# EAGLE design Breakout (EAGLE 7.2.0)
CNAME: EARS PocketQube Template; CREVISION: 0.1; DESIGNER: L. Stant
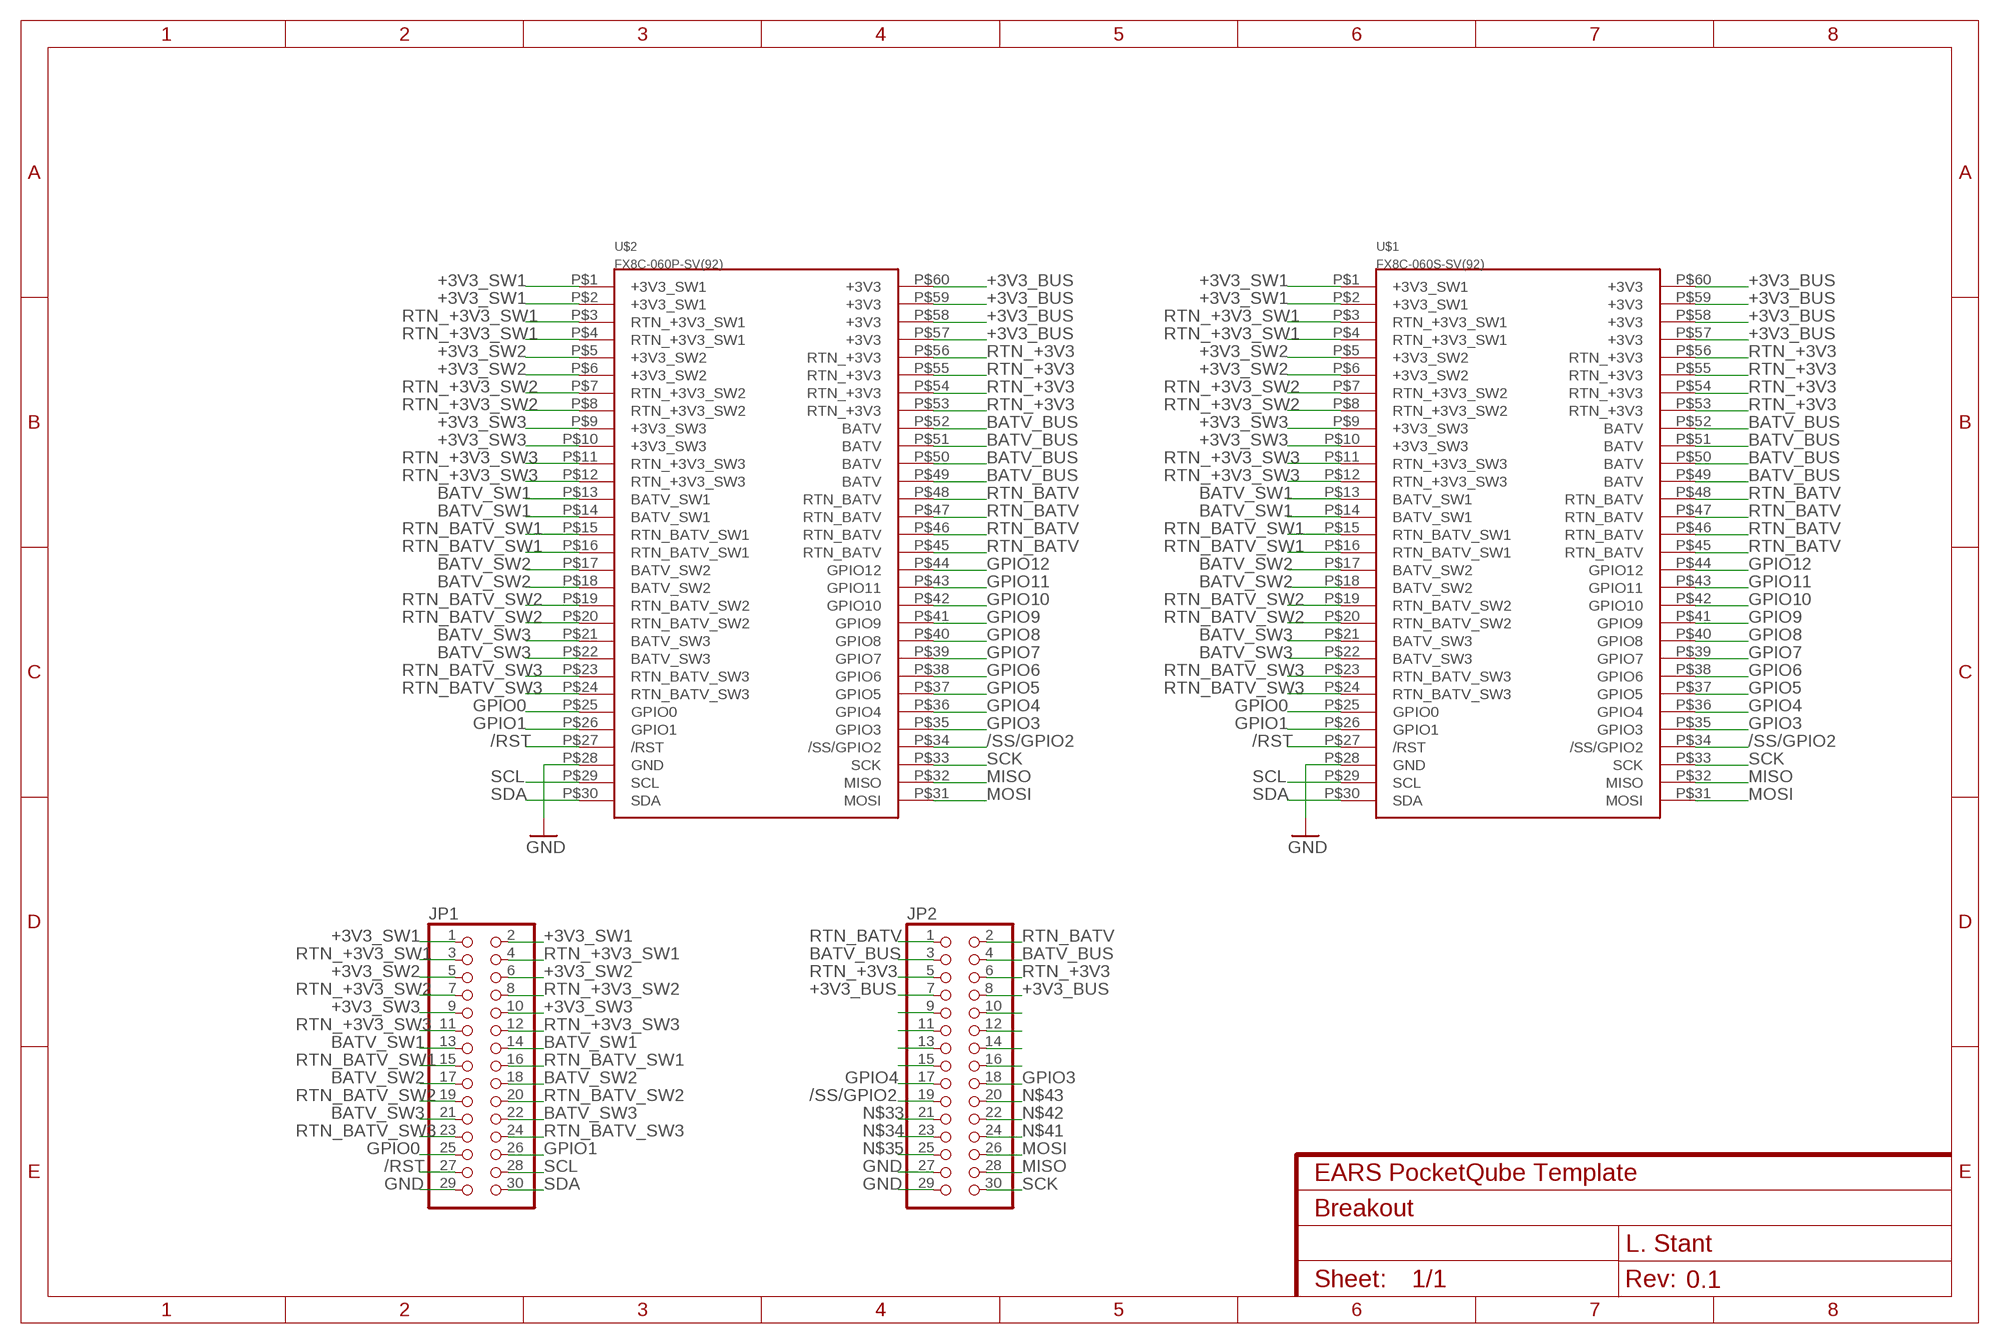
[diagram p0: schematic, sheet 1]

## Parts
JP1  PINHD-2X15  [2X15]
JP2  PINHD-2X15  [2X15]
U$1  FX8C-060S-SV(92)  [FX8C-060S-SV(92)]
U$2  FX8C-060P-SV(92)  [FX8C-060P-SV(92)]

## Nets
+3V3_BUS: JP2.7 JP2.8 U$1.P$57(+3V3) U$1.P$58(+3V3) U$1.P$59(+3V3) U$1.P$60(+3V3) U$2.P$57(+3V3) U$2.P$58(+3V3) U$2.P$59(+3V3) U$2.P$60(+3V3)
+3V3_SW1: JP1.1 JP1.2 U$1.P$1(+3V3_SW1) U$1.P$2(+3V3_SW1) U$2.P$1(+3V3_SW1) U$2.P$2(+3V3_SW1)
+3V3_SW2: JP1.5 JP1.6 U$1.P$5(+3V3_SW2) U$1.P$6(+3V3_SW2) U$2.P$5(+3V3_SW2) U$2.P$6(+3V3_SW2)
+3V3_SW3: JP1.9 JP1.10 U$1.P$9(+3V3_SW3) U$1.P$10(+3V3_SW3) U$2.P$9(+3V3_SW3) U$2.P$10(+3V3_SW3)
/RST: JP1.27 U$1.P$27(/RST) U$2.P$27(/RST)
/SS/GPIO2: JP2.19 U$1.P$34(/SS/GPIO2) U$2.P$34(/SS/GPIO2)
BATV_BUS: JP2.3 JP2.4 U$1.P$49(BATV) U$1.P$50(BATV) U$1.P$51(BATV) U$1.P$52(BATV) U$2.P$49(BATV) U$2.P$50(BATV) U$2.P$51(BATV) U$2.P$52(BATV)
BATV_SW1: JP1.13 JP1.14 U$1.P$13(BATV_SW1) U$1.P$14(BATV_SW1) U$2.P$13(BATV_SW1) U$2.P$14(BATV_SW1)
BATV_SW2: JP1.17 JP1.18 U$1.P$17(BATV_SW2) U$1.P$18(BATV_SW2) U$2.P$17(BATV_SW2) U$2.P$18(BATV_SW2)
BATV_SW3: JP1.21 JP1.22 U$1.P$21(BATV_SW3) U$1.P$22(BATV_SW3) U$2.P$21(BATV_SW3) U$2.P$22(BATV_SW3)
GND: JP1.29 JP2.27 JP2.29 U$1.P$28(GND) U$2.P$28(GND)
GPIO0: JP1.25 U$1.P$25(GPIO0) U$2.P$25(GPIO0)
GPIO1: JP1.26 U$1.P$26(GPIO1) U$2.P$26(GPIO1)
GPIO3: JP2.18 U$1.P$35(GPIO3) U$2.P$35(GPIO3)
GPIO4: JP2.17 U$1.P$36(GPIO4) U$2.P$36(GPIO4)
GPIO5: JP2.16 U$1.P$37(GPIO5) U$2.P$37(GPIO5)
GPIO6: JP2.15 U$1.P$38(GPIO6) U$2.P$38(GPIO6)
GPIO7: JP2.14 U$1.P$39(GPIO7) U$2.P$39(GPIO7)
GPIO8: JP2.13 U$1.P$40(GPIO8) U$2.P$40(GPIO8)
GPIO9: JP2.12 U$1.P$41(GPIO9) U$2.P$41(GPIO9)
GPIO10: JP2.11 U$1.P$42(GPIO10) U$2.P$42(GPIO10)
GPIO11: JP2.10 U$1.P$43(GPIO11) U$2.P$43(GPIO11)
GPIO12: JP2.9 U$1.P$44(GPIO12) U$2.P$44(GPIO12)
MISO: JP2.28 U$1.P$32(MISO) U$2.P$32(MISO)
MOSI: JP2.26 U$1.P$31(MOSI) U$2.P$31(MOSI)
N$33: JP2.21
N$34: JP2.23
N$35: JP2.25
N$41: JP2.24
N$42: JP2.22
N$43: JP2.20
RTN_+3V3: JP2.5 JP2.6 U$1.P$53(RTN_+3V3) U$1.P$54(RTN_+3V3) U$1.P$55(RTN_+3V3) U$1.P$56(RTN_+3V3) U$2.P$53(RTN_+3V3) U$2.P$54(RTN_+3V3) U$2.P$55(RTN_+3V3) U$2.P$56(RTN_+3V3)
RTN_+3V3_SW1: JP1.3 JP1.4 U$1.P$3(RTN_+3V3_SW1) U$1.P$4(RTN_+3V3_SW1) U$2.P$3(RTN_+3V3_SW1) U$2.P$4(RTN_+3V3_SW1)
RTN_+3V3_SW2: JP1.7 JP1.8 U$1.P$7(RTN_+3V3_SW2) U$1.P$8(RTN_+3V3_SW2) U$2.P$7(RTN_+3V3_SW2) U$2.P$8(RTN_+3V3_SW2)
RTN_+3V3_SW3: JP1.11 JP1.12 U$1.P$11(RTN_+3V3_SW3) U$1.P$12(RTN_+3V3_SW3) U$2.P$11(RTN_+3V3_SW3) U$2.P$12(RTN_+3V3_SW3)
RTN_BATV: JP2.1 JP2.2 U$1.P$45(RTN_BATV) U$1.P$46(RTN_BATV) U$1.P$47(RTN_BATV) U$1.P$48(RTN_BATV) U$2.P$45(RTN_BATV) U$2.P$46(RTN_BATV) U$2.P$47(RTN_BATV) U$2.P$48(RTN_BATV)
RTN_BATV_SW1: JP1.15 JP1.16 U$1.P$15(RTN_BATV_SW1) U$1.P$16(RTN_BATV_SW1) U$2.P$15(RTN_BATV_SW1) U$2.P$16(RTN_BATV_SW1)
RTN_BATV_SW2: JP1.19 JP1.20 U$1.P$19(RTN_BATV_SW2) U$1.P$20(RTN_BATV_SW2) U$2.P$19(RTN_BATV_SW2) U$2.P$20(RTN_BATV_SW2)
RTN_BATV_SW3: JP1.23 JP1.24 U$1.P$23(RTN_BATV_SW3) U$1.P$24(RTN_BATV_SW3) U$2.P$23(RTN_BATV_SW3) U$2.P$24(RTN_BATV_SW3)
SCK: JP2.30 U$1.P$33(SCK) U$2.P$33(SCK)
SCL: JP1.28 U$1.P$29(SCL) U$2.P$29(SCL)
SDA: JP1.30 U$1.P$30(SDA) U$2.P$30(SDA)

## Library data of the parts
JP1 JP2 = pinhead:PINHD-2X15: PIN HEADER
U$1 = Template:FX8C-060S-SV(92)
U$2 = Template:FX8C-060P-SV(92)

## Board
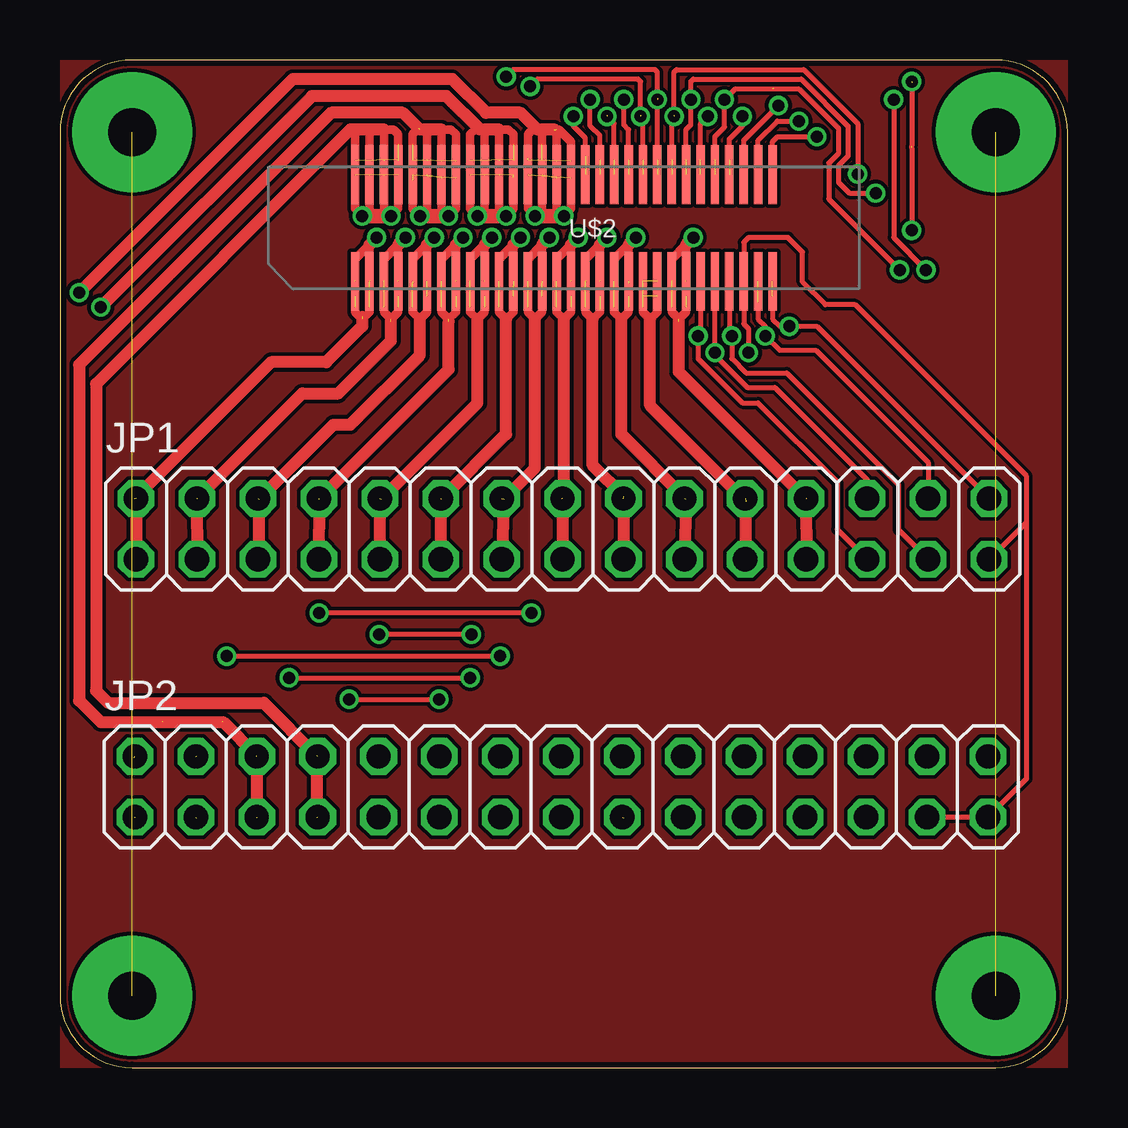
[diagram p1: board, top side]
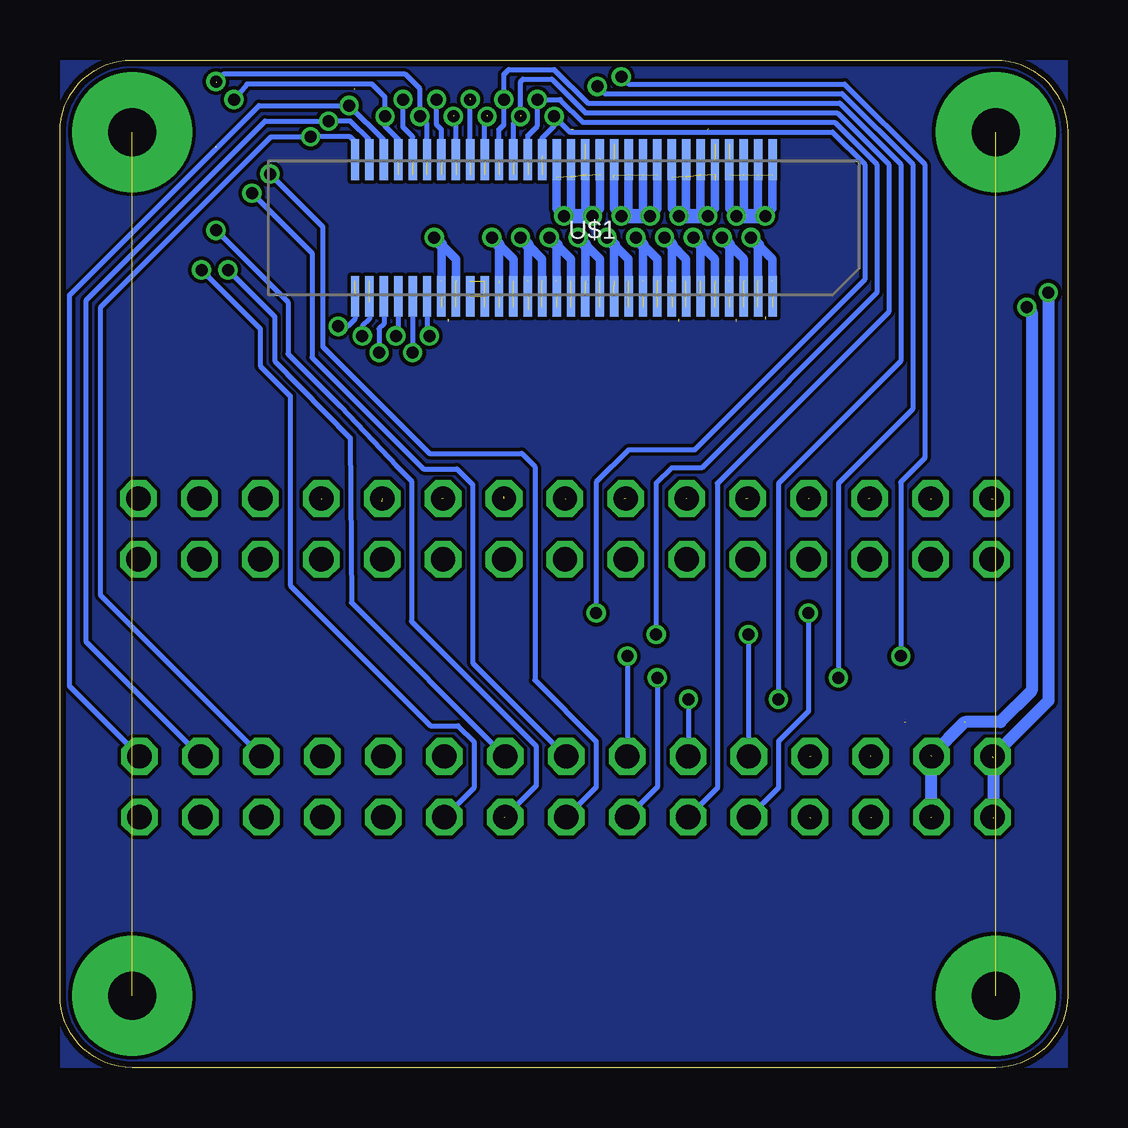
[diagram p2: board, bottom side, seen from below]

Size 42 x 42 mm. Coordinates in mm from the lower left corner, seen from the top.
Outline: 3,0 39,0 arc90 42,3 42,39 arc90 39,42 3,42 arc90 0,39 0,3 arc90 3,0
Copper layers (1*16): Top 0.035mm / dielectric 1.5mm / Bottom 0.035mm
Design rules "SeeedStudio_2layer_DRU_no_angle_20140221 *": minimum track width 6mil, minimum drill 0.5mm, track to track 6mil, track to pad 6mil, pad to pad 6mil, via to via 6mil, smd to smd 0mil, copper to edge 10mil, drill to drill 10mil, minimum pad ring 10mil, minimum via ring 6mil, stop-mask expansion 2mil, vias tented up to drill 100mil, thermal gap 10mil

### Footprints (pad centres in the part's own frame; a part is rotated, then mirrored left to right if it is on the bottom)
2X15 = drill 1.016 octagon: 1 -17.78,-1.27; 2 -17.78,1.27; 3 -15.24,-1.27; 4 -15.24,1.27; 5 -12.7,-1.27; 6 -12.7,1.27; 7 -10.16,-1.27; 8 -10.16,1.27; 9 -7.62,-1.27; 10 -7.62,1.27; 11 -5.08,-1.27; 12 -5.08,1.27; 13 -2.54,-1.27; 14 -2.54,1.27; 15 0,-1.27; 16 0,1.27; 17 2.54,-1.27; 18 2.54,1.27; 19 5.08,-1.27; 20 5.08,1.27; 21 7.62,-1.27; 22 7.62,1.27; 23 10.16,-1.27; 24 10.16,1.27; 25 12.7,-1.27; 26 12.7,1.27; 27 15.24,-1.27; 28 15.24,1.27; 29 17.78,-1.27; 30 17.78,1.27
FX8C-060S-SV(92) = smd 0.35 x 1.7: P$1 -8.7,2.85; P$2 -8.1,2.85; P$3 -7.5,2.85; P$4 -6.9,2.85; P$5 -6.3,2.85; P$6 -5.7,2.85; P$7 -5.1,2.85; P$8 -4.5,2.85; P$9 -3.9,2.85; P$10 -3.3,2.85; P$11 -2.7,2.85; P$12 -2.1,2.85; P$13 -1.5,2.85; P$14 -0.9,2.85; P$15 -0.3,2.85; P$16 0.3,2.85; P$17 0.9,2.85; P$18 1.5,2.85; P$19 2.1,2.85; P$20 2.7,2.85; P$21 3.3,2.85; P$22 3.9,2.85; P$23 4.5,2.85; P$24 5.1,2.85; P$25 5.7,2.85; P$26 6.3,2.85; P$27 6.9,2.85; P$28 7.5,2.85; P$29 8.1,2.85; P$30 8.7,2.85; P$31 8.7,-2.85; P$32 8.1,-2.85; P$33 7.5,-2.85; P$34 6.9,-2.85; P$35 6.3,-2.85; P$36 5.7,-2.85; P$37 5.1,-2.85; P$38 4.5,-2.85; P$39 3.9,-2.85; P$40 3.3,-2.85; P$41 2.7,-2.85; P$42 2.1,-2.85; P$43 1.5,-2.85; P$44 0.9,-2.85; P$45 0.3,-2.85; P$46 -0.3,-2.85; P$47 -0.9,-2.85; P$48 -1.5,-2.85; P$49 -2.1,-2.85; P$50 -2.7,-2.85; P$51 -3.3,-2.85; P$52 -3.9,-2.85; P$53 -4.5,-2.85; P$54 -5.1,-2.85; P$55 -5.7,-2.85; P$56 -6.3,-2.85; P$57 -6.9,-2.85; P$58 -7.5,-2.85; P$59 -8.1,-2.85; P$60 -8.7,-2.85
FX8C-060P-SV(92) = smd 0.35 x 2.45: P$1 -8.7,-2.225; P$2 -8.1,-2.225; P$3 -7.5,-2.225; P$4 -6.9,-2.225; P$5 -6.3,-2.225; P$6 -5.7,-2.225; P$7 -5.1,-2.225; P$8 -4.5,-2.225; P$9 -3.9,-2.225; P$10 -3.3,-2.225; P$11 -2.7,-2.225; P$12 -2.1,-2.225; P$13 -1.5,-2.225; P$14 -0.9,-2.225; P$15 -0.3,-2.225; P$16 0.3,-2.225; P$17 0.9,-2.225; P$18 1.5,-2.225; P$19 2.1,-2.225; P$20 2.7,-2.225; P$21 3.3,-2.225; P$22 3.9,-2.225; P$23 4.5,-2.225; P$24 5.1,-2.225; P$25 5.7,-2.225; P$26 6.3,-2.225; P$27 6.9,-2.225; P$28 7.5,-2.225; P$29 8.1,-2.225; P$30 8.7,-2.225; P$31 8.7,2.225; P$32 8.1,2.225; P$33 7.5,2.225; P$34 6.9,2.225; P$35 6.3,2.225; P$36 5.7,2.225; P$37 5.1,2.225; P$38 4.5,2.225; P$39 3.9,2.225; P$40 3.3,2.225; P$41 2.7,2.225; P$42 2.1,2.225; P$43 1.5,2.225; P$44 0.9,2.225; P$45 0.3,2.225; P$46 -0.3,2.225; P$47 -0.9,2.225; P$48 -1.5,2.225; P$49 -2.1,2.225; P$50 -2.7,2.225; P$51 -3.3,2.225; P$52 -3.9,2.225; P$53 -4.5,2.225; P$54 -5.1,2.225; P$55 -5.7,2.225; P$56 -6.3,2.225; P$57 -6.9,2.225; P$58 -7.5,2.225; P$59 -8.1,2.225; P$60 -8.7,2.225

### Placement (x,y rotation side)
JP1  20.95,22.45 0 top
JP2  20.9,11.7 0 top
U$1  21,35 180 bottom
U$2  21,35 0 top

### Tracks (layer width: path | path; a pad name or v marks a point on that pad's centre or on a via)
+3V3_BUS  (via drill 0.5)  (10 unrouted)
  Top 0.35: U$2.P$57 14.1,35.8 v13.8,35.5 13.5,35.8 13.5,37.2 | 12.9,37.2 12.9,35.8 v12.6,35.5 12.3,35.8 12.3,37.2 | 14.1,38.5 14.1,38.9 13.9,39.1 13.5,39.1 13.5,38.5 | 12.4,39.1 12.3,38.9 12.3,38.5 | 12.9,38.5 12.9,39.1
  Top 0.5: 13.5,39.1 12.9,39.1 12.4,39.1 12.1,39.1 1.5,28.5 1.5,15.7 2,15.2 8.5,15.2 10.7,13 10.7,10.4
  Top 0.6: v12.6,35.5 v13.8,35.5
  Bottom 0.35: 12.3,37.8 12.3,35.8 v12.6,35.5 12.9,35.8 12.9,37.8 | 13.5,37.8 13.5,35.8 v13.8,35.5 14.1,35.8 14.1,37.8
  Bottom 0.6: v12.6,35.5 v13.8,35.5
+3V3_SW1  (via drill 0.5)  (7 unrouted)
  Top 0.35: 12.9,33.8 12.9,34.3 12.3,33.7 12.3,32.8 | 12.9,31.7 12.9,31.5 12.6,31.2 12.3,31.5 12.3,31.7
  Top 0.5: 12.9,34.3 v13.2,34.6 | 12.6,31.3 12.6,30.9 11.1,29.4 8.8,29.4 3.1,23.7 | JP1.2 JP1.1
  Bottom 0.35: 12.9,32.8 12.9,34.3 12.3,33.7 12.3,32.8
  Bottom 0.5: 12.9,34.3 v13.2,34.6
+3V3_SW2  (via drill 0.5)  (6 unrouted)
  Top 0.35: 15.3,33.8 15.3,34.3 14.7,33.7 | 15.3,31.6 15.3,31.5 15,31.2 14.7,31.5 14.7,31.7
  Top 0.5: 15.3,34.3 v15.6,34.6 | 15,31.2 15,29.7 12.1,26.8 11.4,26.8 8.3,23.7 JP1.5
  Bottom 0.35: 15.3,32.7 15.3,34.3 14.7,33.7 14.7,32.7
  Bottom 0.5: v15.6,34.6 15.3,34.3
+3V3_SW3  (via drill 0.5)  (6 unrouted)
  Top 0.35: 17.7,33.8 17.7,34.3 17.1,33.7 | 17.7,31.7 17.7,31.5 17.4,31.2 17.1,31.5 17.1,31.7
  Top 0.5: 17.7,34.3 v18,34.6 | 13.4,23.7 17.4,27.7 17.4,31.2 | JP1.10 JP1.9
  Bottom 0.35: 17.7,32.8 17.7,34.3 17.1,33.7 17.1,32.8
  Bottom 0.5: v18,34.6 17.7,34.3
/RST  (via drill 0.5)
  Top 0.2: U$2.P$27 27.9,30.6 v28,30.5 28,29.55 28.6,28.95 30.3,28.95 34.95,24.3 34.95,22.42 JP1.27
  Bottom 0.2: U$1.P$27 27.9,30.6 v28,30.5
/SS/GPIO2  (via drill 0.5)  (1 unrouted)
  Top 0.2: 27.9,38.2 27.9,38.7 28.45,39.25 v28.45,39.65 | v34.75,40.35 34.75,34.6 v36.1,33.25
  Bottom 0.2: U$1.P$34 27.9,38.7 28.45,39.25 v28.45,39.65 28.45,40.45 29,41 34.2,41 v34.75,40.35 | v36.1,33.25 33.65,30.8 33.65,29.25 32.4,28 32.4,20.1 26.55,14.25 25.4,14.25 24.75,13.6 24.75,11.65 JP2.19
BATV_BUS  (via drill 0.5)  (12 unrouted)
  Top 0.35: 17.1,37.2 17.1,35.8 v17.4,35.5 17.7,35.8 17.7,37.2 | 18.3,37.2 18.3,35.8 v18.6,35.5 18.9,35.8 18.9,37.1 | 18.9,38.5 18.9,38.9 18.7,39.1 18.3,39.1 18.3,38.5 | 17.1,38.5 17.1,38.9 17.3,39.1 17.5,39.1 | 17.7,38.5 17.7,39.1
  Top 0.5: 18.3,39.1 17.7,39.1 17.5,39.1 16.1,40.5 10.5,40.5 v1.7,31.7
  Top 0.6: v17.4,35.5 v18.6,35.5
  Bottom 0.35: 17.1,37.8 17.1,35.8 v17.4,35.5 17.7,35.8 17.7,37.8 | 18.3,37.8 18.3,35.8 v18.6,35.5 18.9,35.8 18.9,37.8
  Bottom 0.5: 4.27,14.4 2.8,14.4 1.5,15.7 1.5,31.5 v1.7,31.7 | 4.3,14.4 5.7,13 5.7,10.4
  Bottom 0.6: v17.4,35.5 v18.6,35.5
BATV_SW1  (via drill 0.5)  (6 unrouted)
  Top 0.35: 20.1,33.8 20.1,34.3 19.5,33.7 | 20.1,31.6 20.1,31.5 19.8,31.2 19.5,31.5 19.5,31.7
  Top 0.5: v20.4,34.6 20.1,34.3 | 19.8,31.2 19.8,25 18.5,23.7 JP1.13
  Bottom 0.35: 20.1,32.7 20.1,34.3 19.5,33.7 19.5,32.6
  Bottom 0.5: v20.4,34.6 20.1,34.3
BATV_SW2  (via drill 0.5)  (6 unrouted)
  Top 0.35: 22.5,33.8 22.5,34.3 21.9,33.7 | 22.5,31.6 22.5,31.5 22.2,31.2 21.9,31.5 21.9,31.7
  Top 0.5: v22.8,34.6 22.5,34.3 | 23.5,23.8 22.2,25.1 22.2,31.2 | JP1.18 JP1.17
  Bottom 0.35: 22.5,32.8 22.5,34.3 21.9,33.7 21.9,32.8
  Bottom 0.5: v22.8,34.6 22.5,34.3
BATV_SW3  (5 unrouted)
  Top 0.35: 24.9,31.5 24.6,31.2 24.3,31.5 24.3,31.7
  Top 0.5: 28.6,23.6 24.6,27.6 24.6,31.2 | JP1.22 JP1.21
BOARD
  pour Bottom: 0,42 42,42 42,0 0,0
  pour Top: 0,42 42,42 42,0 0,0
CHASSIS_GND  (via drill 2 pad 5)  (1 unrouted)
  other vias: 39,39 39,3
GND  (via drill 0.5)
  Top 0.2: v28.7,29.8 28.7,30.8 28.5,31 U$2.P$28 28.5,34.4 28.7,34.6 30.35,34.6 30.95,34 30.95,32.75 31.9,31.8 33.15,31.8 40.3,24.65 40.3,22.75 | JP1.29 40.3,22.75 | 40.3,22.75 40.3,12.05 JP2.29 JP2.27
  Bottom 0.2: U$1.P$28 28.5,31 28.7,30.8 v28.7,29.8
GPIO0  (via drill 0.5)
  Top 0.2: U$2.P$25 26.7,30.6 v26.6,30.5 26.6,29.55 28.45,27.7 29.1,27.7 32.4,24.4 32.4,22.43 JP1.25
  Bottom 0.2: U$1.P$25 26.7,30.6 v26.6,30.5
GPIO1  (via drill 0.5)
  Top 0.2: U$2.P$26 v27.3,29.8 27.3,29.7 28.65,28.35 29.8,28.35 33.65,24.5 JP1.26
  Bottom 0.2: U$1.P$26 v27.3,29.8
GPIO3  (via drill 0.5)  (2 unrouted)
  Top 0.2: 27.3,38.1 27.3,38.8 27.7,39.2 v27.7,40.35 28.15,40.8 29.7,40.8 | 29.75,40.8 30.8,40.8 32.45,39.15 32.45,38.1 32.05,37.7 32.05,36.2 v35,33.25
  Bottom 0.2: U$1.P$35 27.3,38.8 27.7,39.2 v27.7,40.35 | v35,33.25 33.05,31.3 33.05,29.45 29.9,26.25 29.85,19.38 JP2.18
GPIO4  (via drill 0.5)  (4 unrouted)
  Top 0.2: 26.7,38.1 26.7,39.35 v27,39.65 | 35.5,41.05 35.5,38.4 | 35.5,38.35 v35.5,34.9
  Bottom 0.2: U$1.P$36 26.7,39.35 v27,39.65 27,40.8 27.6,41.4 35.2,41.4 v35.5,41.1 | v35.5,34.9 32.5,31.9 32.5,29.75 30.3,27.55 27.95,25.05 27.35,24.45 27.35,18.6 22.15,13.4 22.15,11.75 23.5,10.4
GPIO5  (via drill 0.5)  (1 unrouted)
  Top 0.2: 26.1,38.2 26.1,39.1 26.3,39.3 v26.3,40.35 26.3,41.1 26.4,41.2 30.9,41.2 32.85,39.25 32.85,38 32.45,37.6 32.45,36.9 32.9,36.45 v34,36.45
  Bottom 0.2: U$1.P$37 26.1,39.1 26.3,39.3 v26.3,40.35 | v34,36.45 31.5,33.95 31.5,29.6 26.85,24.95 25.45,24.95 24.8,24.3 24.8,16.87 JP2.16
GPIO6  (via drill 0.5)  (2 unrouted)
  Top 0.2: 25.5,38.2 25.5,39.55 v25.6,39.65 | 25.6,39.7 25.6,41.5 25.7,41.6 31,41.6 33.25,39.35 v33.25,37.25
  Bottom 0.2: U$1.P$38 25.5,39.55 v25.6,39.65 | v33.25,37.25 31.05,35.05 31.05,30.05 26.6,25.6 22.75,25.6 22.2,25.05 22.2,16.15 19.65,13.6 19.65,11.68 JP2.15
GPIO7  (via drill 0.5)  (2 unrouted)
  Top 0.2: 24.9,38.2 v24.9,40.35 | 24.9,40.4 24.9,41.5 24.8,41.6 18.9,41.6 v18.6,41.3 | v6.95,17.15 v18.35,17.15
  Bottom 0.2: U$1.P$39 v24.9,40.35 | v18.6,41.3 18.3,41 9.3,41 5.95,37.65 5.95,25.4 6.95,24.4 v6.95,17.15 | v18.35,17.15 JP2.14
GPIO8  (via drill 0.5)  (2 unrouted)
  Top 0.2: 24.3,38.1 24.3,39.55 v24.2,39.65 | 24.2,39.7 24.2,41.1 24.1,41.2 19.9,41.2 v19.6,40.9 | v9.55,16.25 v17.1,16.25
  Bottom 0.2: U$1.P$40 24.3,39.55 v24.2,39.65 | v19.6,40.9 19.3,40.6 9.4,40.6 6.45,37.65 6.45,27.45 9.55,24.35 v9.55,16.25 | v17.1,16.25 17.1,11.69 JP2.13
GPIO9  (via drill 0.5)  (1 unrouted)
  Top 0.2: 23.7,38.3 23.7,39.1 23.5,39.3 v23.5,40.35 | v12.05,15.35 v15.8,15.35
  Bottom 0.2: U$1.P$41 23.7,39.1 23.5,39.3 v23.5,40.35 23.5,41.4 23.3,41.6 21.4,41.6 20,40.2 9.5,40.2 6.95,37.65 6.95,29.45 12.05,24.35 v12.05,15.35 | v15.8,15.35 15.8,12.99 JP2.12
GPIO10  (via drill 0.5)  (2 unrouted)
  Top 0.2: 23.1,38.1 23.1,39.35 v22.8,39.65
  Bottom 0.2: U$1.P$42 23.1,39.35 v22.8,39.65 | 22.8,39.7 22.8,41.1 22.7,41.2 21.5,41.2 20.1,39.8 9.6,39.8 7.45,37.65 7.45,31.5 14.6,24.35 14.6,11.65 JP2.11
GPIO11  (via drill 0.5)  (1 unrouted)
  Top 0.2: 22.5,38.3 22.5,38.85 22.1,39.25 v22.1,40.35 | v17.15,18.05 v13.3,18.05
  Bottom 0.2: U$1.P$43 22.5,38.85 22.1,39.25 v22.1,40.35 21.15,40.35 20.2,39.4 9.7,39.4 7.95,37.65 7.95,32.3 15.25,25 16.5,25 17.15,24.35 v17.15,18.05 | v13.3,18.05 13.3,12.99 JP2.10
GPIO12  (via drill 0.5)  (2 unrouted)
  Top 0.2: 21.9,38 21.9,38.75 21.4,39.25 v21.4,39.65 | v19.65,18.95 v10.8,18.95
  Bottom 0.2: 21.9,38.45 21.9,38.75 21.4,39.25 v21.4,39.65 20.75,39 9.8,39 8.45,37.65 8.45,32.85 15.55,25.75 18.3,25.75 19.65,24.4 v19.65,18.95 | v10.8,18.95 10.8,14.85 12.05,13.6 12.05,11.66 JP2.9
MISO  (via drill 0.5)
  Top 0.2: U$2.P$32 29.1,38.65 29.9,39.45 v30.8,39.45
  Bottom 0.2: U$1.P$32 29.1,38.65 29.9,39.45 v30.8,39.45 33.45,39.45 40.9,32 40.9,17.73 JP2.28
MOSI  (via drill 0.5)
  Top 0.2: U$2.P$31 29.7,38.6 29.9,38.8 v31.55,38.8
  Bottom 0.2: U$1.P$31 29.7,38.6 29.9,38.8 v31.55,38.8 33.2,38.8 40.3,31.7 40.3,19.67 JP2.26
N$24  (via drill 2 pad 5)  (1 unrouted)
  other vias: 3,39 3,3
RTN_+3V3  (via drill 0.5)  (13 unrouted)
  Top 0.35: 14.7,37 14.7,35.8 v15,35.5 15.3,35.8 15.3,37.2 | 15.9,37.1 15.9,35.8 v16.2,35.5 16.5,35.8 16.5,37.1 | 16.5,38.5 16.5,38.9 16.3,39.1 15.9,39.1 15.9,38.5 | 14.7,38.5 14.7,38.9 14.94,39.13 14.97,39.13 | 15.3,38.5 15.3,39.1
  Top 0.5: 15.9,39.1 15.3,39.1 15,39.1 14.3,39.8 11.3,39.8 0.8,29.3 0.8,15.3 1.7,14.4 6.75,14.4 | 6.8,14.4 8.2,13 8.2,10.4
  Top 0.6: v15,35.5 v16.2,35.5
  Bottom 0.35: 14.7,37.8 14.7,35.8 v15,35.5 15.3,35.8 15.3,37.8 | 15.9,37.8 15.9,35.8 v16.2,35.5 16.5,35.8 16.5,37.8
  Bottom 0.6: v15,35.5 v16.2,35.5
RTN_+3V3_SW1  (via drill 0.5)  (7 unrouted)
  Top 0.35: 14.1,33.9 14.1,34.3 13.5,33.7 | 14.1,31.7 14.1,31.5 13.8,31.2 13.5,31.5 13.5,31.7
  Top 0.5: v14.4,34.6 14.1,34.3 | 13.8,31.1 13.8,30.3 11.6,28.1 10.1,28.1 5.7,23.7 JP1.3
  Bottom 0.35: 14.1,32.8 14.1,34.3 13.5,33.7 13.5,32.8
  Bottom 0.5: v14.4,34.6 14.1,34.3
RTN_+3V3_SW2  (via drill 0.5)  (7 unrouted)
  Top 0.35: 16.5,33.8 16.5,34.3 15.9,33.7 | 16.5,31.7 16.5,31.5 16.2,31.2 15.9,31.5 15.9,31.7
  Top 0.5: 16.5,34.3 v16.8,34.6 | 16.2,31.1 16.2,29.1 10.8,23.7 JP1.7
  Bottom 0.35: 16.5,32.8 16.5,34.3 15.9,33.7 15.9,32.7
  Bottom 0.5: v16.8,34.6 16.5,34.3
RTN_+3V3_SW3  (via drill 0.5)  (6 unrouted)
  Top 0.35: 18.9,33.8 18.9,34.3 18.3,33.7 | 18.9,31.6 18.9,31.5 18.6,31.2 18.3,31.5 18.3,31.7
  Top 0.5: v19.2,34.6 18.9,34.3 | 15.9,23.7 18.6,26.4 18.6,31.2 | JP1.12 JP1.11
  Bottom 0.35: 18.9,32.6 18.9,34.3 18.3,33.7 18.3,32.7
  Bottom 0.5: v19.2,34.6 18.9,34.3
RTN_BATV  (via drill 0.5)  (12 unrouted)
  Top 0.35: 19.5,37.2 19.5,35.8 v19.8,35.5 20.1,35.8 20.1,37.2 | 20.7,37.1 20.7,35.8 v21,35.5 21.3,35.8 21.3,37.1 | 21.3,38.5 21.3,38.6 20.8,39.1 20.7,39.1 20.7,38.5 | 19.5,38.5 19.5,38.9 19.8,39.2 | 20.1,38.5 20.1,39.1
  Top 0.5: 20.6,39.1 20.1,39.1 19.9,39.1 19.8,39.2 19.2,39.8 17.75,39.8 16.35,41.2 9.7,41.2 v0.8,32.3
  Top 0.6: v19.8,35.5 v21,35.5
  Bottom 0.35: 19.5,37.9 19.5,35.8 v19.8,35.5 20.1,35.8 20.1,37.9 | 20.7,37.8 20.7,35.8 v21,35.5 21.3,35.8 21.3,37.8
  Bottom 0.5: v0.8,32.3 0.8,15.29 JP2.2 | 3.1,12.9 3.1,10.4
  Bottom 0.6: v19.8,35.5 v21,35.5
RTN_BATV_SW1  (via drill 0.5)  (6 unrouted)
  Top 0.35: 21.3,33.9 21.3,34.3 20.7,33.7 | 21.3,31.7 21.3,31.5 21,31.2 20.7,31.5 20.7,31.7 | 20.9,23.7 21,23.8
  Top 0.5: v21.6,34.6 21.3,34.3 | 21,23.8 21,31.2 | JP1.16 JP1.15
  Bottom 0.35: 21.3,32.8 21.3,34.3 20.7,33.7 20.7,32.7
  Bottom 0.5: v21.6,34.6 21.3,34.3
RTN_BATV_SW2  (via drill 0.5)  (6 unrouted)
  Top 0.35: 23.7,33.8 23.7,34.3 23.1,33.7 | 23.7,31.7 23.7,31.5 23.4,31.2 23.1,31.5 23.1,31.7
  Top 0.5: v24,34.6 23.7,34.3 | 23.4,31.2 23.4,26.4 26.1,23.7 JP1.19
  Bottom 0.35: 23.7,32.7 23.7,34.3 23.1,33.7 23.1,32.7
  Bottom 0.5: v24,34.6 23.7,34.3
RTN_BATV_SW3  (via drill 0.5)  (7 unrouted)
  Top 0.35: 26.1,33.8 26.1,34.3 25.5,33.7 | 26.1,31.7 26.1,31.5 25.8,31.2 25.5,31.5 25.5,31.7
  Top 0.5: v26.4,34.6 26.1,34.3 | 25.8,31.1 25.8,29 31.1,23.7 JP1.23
  Bottom 0.35: 26.1,32.8 26.1,34.3 25.5,33.7 25.5,32.8
  Bottom 0.5: v26.4,34.6 26.1,34.3
SCK  (via drill 0.5)
  Top 0.2: U$2.P$33 28.5,38.65 v29.95,40.1
  Bottom 0.2: U$1.P$33 28.5,38.65 v29.95,40.1 33.7,40.1 41.6,32.2 41.6,15.89 JP2.30
SCL  (via drill 0.5)  (2 unrouted)
  Top 0.2: 29.1,31.7 29.1,31.2 29.4,30.9 v29.4,30.5 30,29.9 31.5,29.9 36.19,25.21 JP1.28
  Bottom 0.2: 29.1,31.9 29.1,31.2 29.4,30.9 v29.4,30.5
SDA  (via drill 0.5)  (2 unrouted)
  Top 0.2: 29.7,31.7 29.7,31.2 30,30.9 v30.4,30.9 31.55,30.9 JP1.30
  Bottom 0.2: 29.7,32.2 29.7,31.2 30,30.9 v30.4,30.9

### Text on the board
tDocu: SurreyEARS Pocketqube | Breakout Board | V0.1